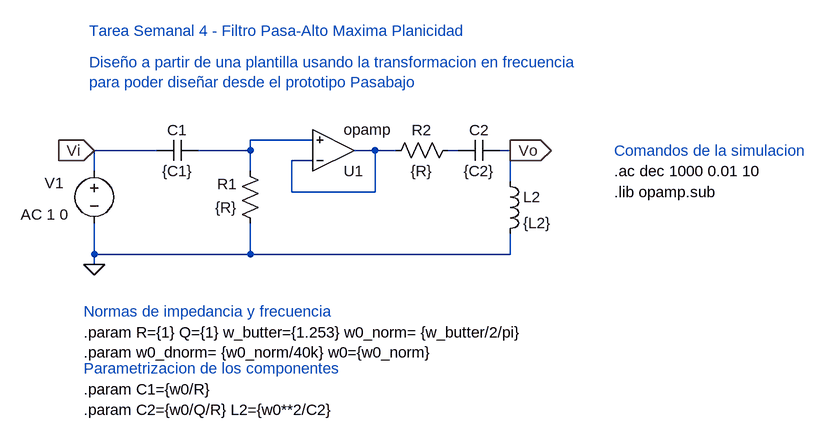
[diagram p0: schematic pasaalto_pasivo.asc]
pasaalto_pasivo.asc, the LTspice schematic file:
Version 4
SHEET 1 1452 680
WIRE 256 48 160 48
WIRE 16 64 -80 64
WIRE 160 64 160 48
WIRE 160 64 80 64
WIRE 352 64 320 64
WIRE 384 64 352 64
WIRE 480 64 464 64
WIRE 560 64 544 64
WIRE 256 80 224 80
WIRE -80 96 -80 64
WIRE 160 96 160 64
WIRE 560 112 560 64
WIRE 224 128 224 80
WIRE 352 128 352 64
WIRE 352 128 224 128
WIRE -80 224 -80 176
WIRE 160 224 160 176
WIRE 160 224 -80 224
WIRE 560 224 560 192
WIRE 560 224 160 224
WIRE -80 240 -80 224
FLAG -80 64 Vi
IOPIN -80 64 In
FLAG 560 64 Vo
IOPIN 560 64 Out
FLAG -80 240 0
SYMBOL res 176 192 R180
WINDOW 0 36 76 Left 2
WINDOW 3 36 40 Left 2
SYMATTR InstName R1
SYMATTR Value {R}
SYMBOL res 480 48 R90
WINDOW 0 0 56 VBottom 2
WINDOW 3 32 56 VTop 2
SYMATTR InstName R2
SYMATTR Value {R}
SYMBOL cap 80 48 R90
WINDOW 0 0 32 VBottom 2
WINDOW 3 32 32 VTop 2
SYMATTR InstName C1
SYMATTR Value {C1}
SYMBOL cap 544 48 R90
WINDOW 0 0 32 VBottom 2
WINDOW 3 32 32 VTop 2
SYMATTR InstName C2
SYMATTR Value {C2}
SYMBOL ind 544 96 R0
SYMATTR InstName L2
SYMATTR Value {L2}
SYMBOL Opamps\\opamp 288 128 M180
SYMATTR InstName U1
SYMBOL voltage -80 80 R0
WINDOW 0 -76 34 Left 2
WINDOW 3 -82 83 Left 2
WINDOW 123 -113 83 Left 2
WINDOW 39 0 0 Left 0
SYMATTR InstName V1
SYMATTR Value ""
SYMATTR Value2 AC 1 0
TEXT 720 128 Left 2 !.lib opamp.sub
TEXT 720 96 Left 2 !.ac dec 1000 0.01 10
TEXT -88 -72 Left 2 ;Diseño a partir de una plantilla usando la transformacion en frecuencia\npara poder diseñar desde el prototipo Pasabajo
TEXT -88 -120 Left 2 ;Tarea Semanal 4 - Filtro Pasa-Alto Maxima Planicidad
TEXT 720 64 Left 2 ;Comandos de la simulacion
TEXT -96 344 Left 2 !.param R={1} Q={1} w_butter={1.253} w0_norm= {w_butter/2/pi}\n.param w0_dnorm= {w0_norm/40k} w0={w0_norm}
TEXT -96 432 Left 2 !.param C1={w0/R}\n.param C2={w0/Q/R} L2={w0**2/C2}
TEXT -96 312 Left 2 ;Normas de impedancia y frecuencia
TEXT -96 400 Left 2 ;Parametrizacion de los componentes

The netlist it stands for:
* pasaalto_pasivo.asc
R1 0 N001 {R}
R2 N003 N002 {R}
C1 N001 Vi {C1}
C2 Vo N003 {C2}
L2 Vo 0 {L2}
XU1 N002 N001 N002 opamp Aol=100K GBW=10Meg  ; pins invin noninvin out
V1 Vi 0 AC 1 0
.lib opamp.sub
.ac dec 1000 0.01 10
* Diseño a partir de una plantilla usando la transformacion en frecuencia
* para poder diseñar desde el prototipo Pasabajo
* Tarea Semanal 4 - Filtro Pasa-Alto Maxima Planicidad
* Comandos de la simulacion
.param R={1} Q={1} w_butter={1.253} w0_norm= {w_butter/2/pi}
.param w0_dnorm= {w0_norm/40k} w0={w0_norm}
.param C1={w0/R}
.param C2={w0/Q/R} L2={w0**2/C2}
* Normas de impedancia y frecuencia
* Parametrizacion de los componentes
.backanno
.end